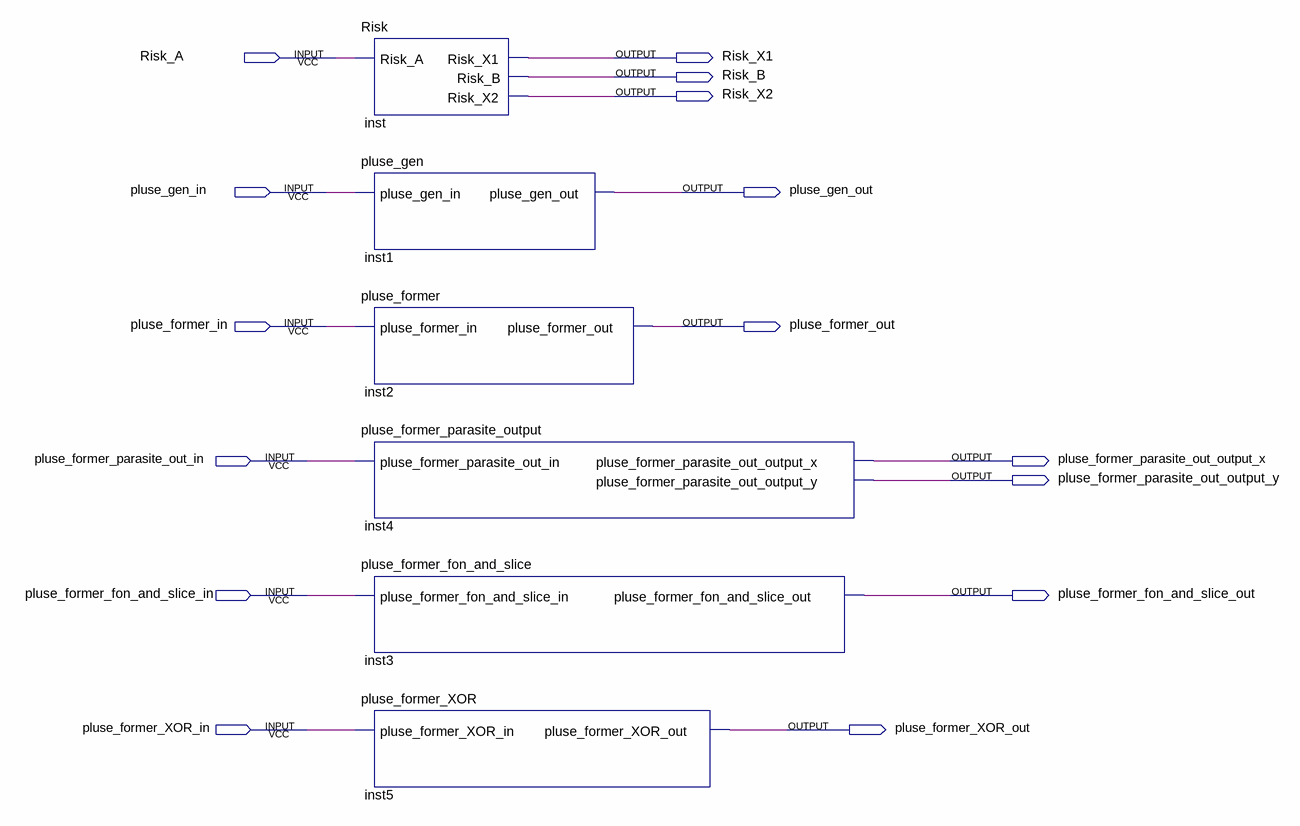
[diagram p0: schematic sheet]
// Quartus schematic lab2.bdf as structural Verilog: 6 symbols, 15 pins
module lab2 (
  input  Risk_A,
  input  pluse_gen_in,
  input  pluse_former_in,
  input  pluse_former_parasite_out_in,
  input  pluse_former_fon_and_slice_in,
  input  pluse_former_XOR_in,
  output Risk_X1,
  output Risk_B,
  output Risk_X2,
  output pluse_gen_out,
  output pluse_former_out,
  output pluse_former_parasite_out_output_x,
  output pluse_former_parasite_out_output_y,
  output pluse_former_fon_and_slice_out,
  output pluse_former_XOR_out
);

  Risk inst (.Risk_A(Risk_A), .Risk_X1(Risk_X1), .Risk_B(Risk_B), .Risk_X2(Risk_X2));
  pluse_gen inst1 (.pluse_gen_in(pluse_gen_in), .pluse_gen_out(pluse_gen_out));
  pluse_former inst2 (.pluse_former_in(pluse_former_in), .pluse_former_out(pluse_former_out));
  pluse_former_parasite_output inst4 (
    .pluse_former_parasite_out_in(pluse_former_parasite_out_in),
    .pluse_former_parasite_out_output_x(pluse_former_parasite_out_output_x),
    .pluse_former_parasite_out_output_y(pluse_former_parasite_out_output_y));
  pluse_former_fon_and_slice inst3 (
    .pluse_former_fon_and_slice_in(pluse_former_fon_and_slice_in),
    .pluse_former_fon_and_slice_out(pluse_former_fon_and_slice_out));
  pluse_former_XOR inst5 (.pluse_former_XOR_in(pluse_former_XOR_in), .pluse_former_XOR_out(pluse_former_XOR_out));
endmodule
